# EAGLE design tinyha_blinds2 (EAGLE 7.5.0)
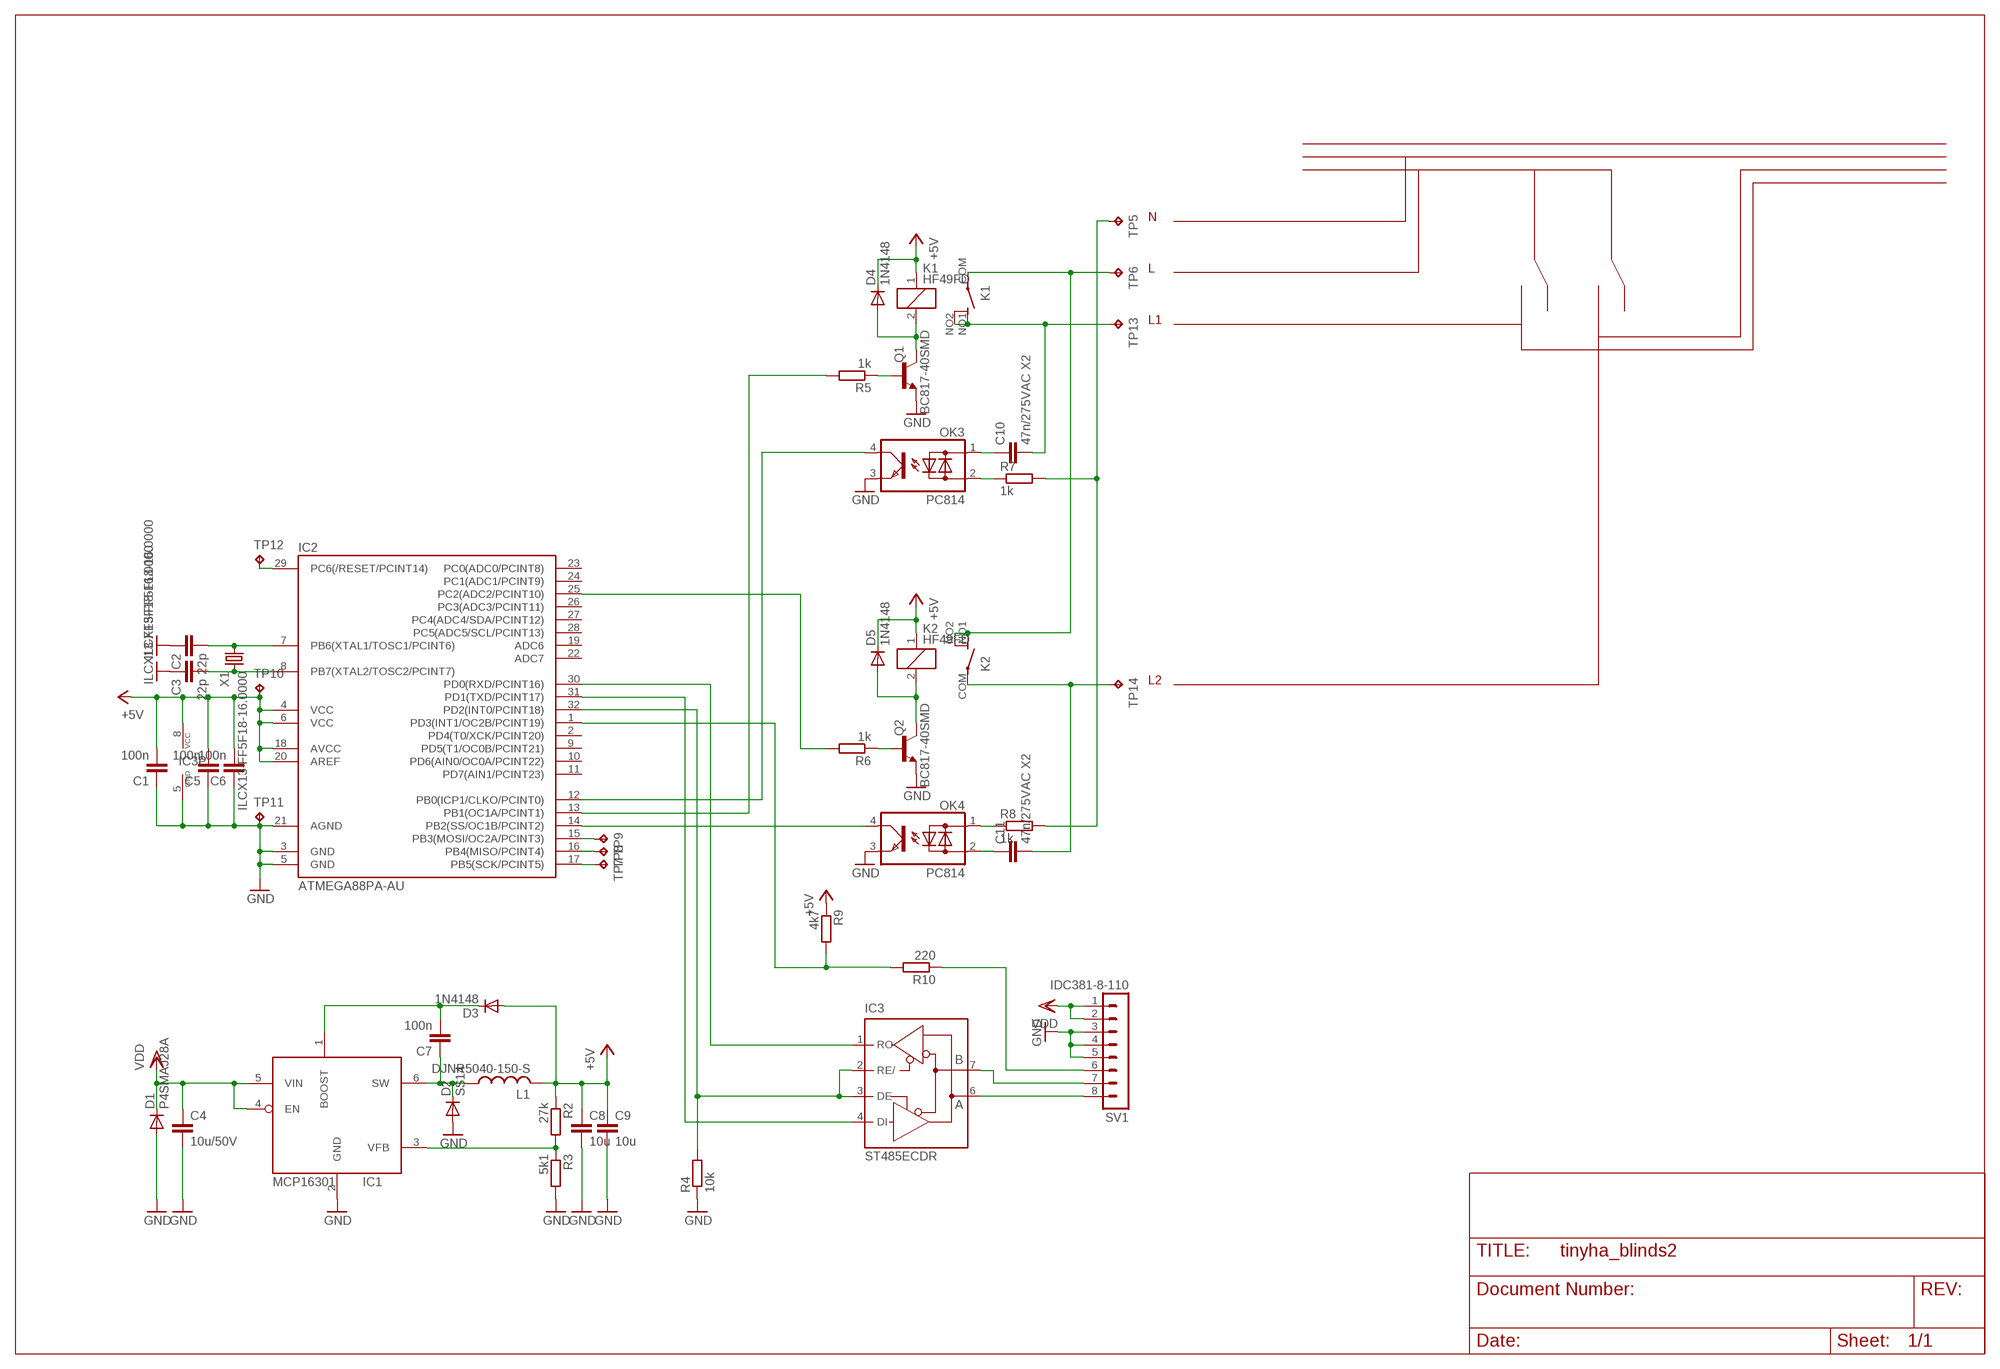
[diagram p0: schematic, sheet 1]

## Parts
C1  100n  C-EUC0603K  [C0603K]
C2  22p  C-EUC0603K  [C0603K]
C3  22p  C-EUC0603K  [C0603K]
C4  10u/50V  C-EUC1210K  [C1210K]
C5  100n  C-EUC0603K  [C0603K]
C6  100n  C-EUC0603K  [C0603K]
C7  100n  C-EUC0603K  [C0603K]
C8  10u  C-EUC0805K  [C0805K]
C9  10u  C-EUC0805K  [C0805K]
C10  47n/275VAC X2  C10/5  [C10B5]
C11  47n/275VAC X2  C10/5  [C10B5]
D1  P4SMAJ28A  DIODE-DO214AC  [DO214AC]
D2  SS14  DIODE-DO214AC  [DO214AC]
D3  1N4148  DIODE-MICROMELF-W  [MICROMELF-W]
D4  1N4148  DIODE-MICROMELF-W  [MICROMELF-W]
D5  1N4148  DIODE-MICROMELF-W  [MICROMELF-W]
IC1  MCP16301  [SOT23-6L]
IC2  ATMEGA88PA-AU  ATMEGA48/88/168-MU  [MLF32]
IC3  ST485ECDR  MAX481CSA  [SO08]
K1  HF49FD  [HF49D]
K2  HF49FD  [HF49D]
L1  DJNR5040-150-S  DJNR5040  [DJNR5040]
OK3  PC814  [DIL04]
OK4  PC814  [DIL04]
Q1  BC817-40SMD  [SOT23-BEC]
Q2  BC817-40SMD  [SOT23-BEC]
R2  27k  R-EU_R0603  [R0603]
R3  5k1  R-EU_R0603  [R0603]
R4  10k  R-EU_R0603  [R0603]
R5  1k  R-EU_R0603  [R0603]
R6  1k  R-EU_R0603  [R0603]
R7  1k  R-EU_0207/10  [0207/10]
R8  1k  R-EU_0207/10  [0207/10]
R9  4k7  R-EU_R0603  [R0603]
R10  220  R-EU_R0603  [R0603]
SV1  IDC381-8-110  MA08-1-IDC  [IDC381-8]
TP5  TP230  [P1-20]
TP6  TP230  [P1-20]
TP7  TPB1,27  [B1,27]
TP8  TPB1,27  [B1,27]
TP9  TPB1,27  [B1,27]
TP10  TPB1,27  [B1,27]
TP11  TPB1,27  [B1,27]
TP12  TPB1,27  [B1,27]
TP13  TP230  [P1-20]
TP14  TP230  [P1-20]
X1  ILCX13-FF5F18-16.0000  XTAL-3225  [SMD3225]

## Nets
+5V: C1.2 C5.2 C6.2 C8.1 C9.1 D3.A D4.C D5.C IC2.4(VCC) IC2.6(VCC) IC2.18(AVCC) IC2.20(AREF) IC3.8(VCC) K1.1 K2.1 L1.2 R2.1 R9.1 TP10.TP
DIR: IC2.32(PD2(INT0/PCINT18)) IC3.2(RE/) IC3.3(DE) R4.2
GND: C1.1 C2.1 C3.1 C4.2 C5.1 C6.1 C8.2 C9.2 D1.A D2.A IC1.2(GND) IC2.3(GND) IC2.5(GND) IC2.21(AGND) IC3.5(GND) OK3.3(E) OK4.3(E) Q1.E Q2.E R3.2 R4.1 SV1.3 SV1.4 SV1.5 TP11.TP X1.2(GND) X1.4(GND)
N$1: R7.2 R8.2 TP5.TP
N$2: C11.2 K2.COM(P) TP14.TP
N$3: C10.2 K1.NO1(S1) K1.NO2(S2) TP13.TP
N$4: Q2.B R6.1
N$5: Q1.B R5.1
N$6: IC2.13(PB1(OC1A/PCINT1)) R5.2
N$7: IC2.25(PC2(ADC2/PCINT10)) R6.2
N$8: IC2.29(PC6(/RESET/PCINT14)) TP12.TP
N$9: IC2.12(PB0(ICP1/CLKO/PCINT0)) OK3.4(C)
N$10: IC3.7(B) SV1.7
N$11: D5.A K2.2 Q2.C
N$12: IC2.14(PB2(SS/OC1B/PCINT2)) OK4.4(C)
N$13: OK4.1(AC1) R8.1
N$14: IC1.3(VFB) R2.2 R3.1
N$15: IC2.15(PB3(MOSI/OC2A/PCINT3)) TP9.TP
N$16: K1.COM(P) K2.NO1(S1) K2.NO2(S2) TP6.TP
N$17: C11.1 OK4.2(AC2)
N$18: R10.1 SV1.6
N$19: IC2.1(PD3(INT1/OC2B/PCINT19)) R9.2 R10.2
N$20: C7.1 D2.C IC1.6(SW) L1.1
N$21: D4.A K1.2 Q1.C
N$22: C7.2 D3.C IC1.1(BOOST)
N$23: IC3.6(A) SV1.8
N$24: C3.2 IC2.8(PB7(XTAL2/TOSC2/PCINT7)) X1.3
N$31: C2.2 IC2.7(PB6(XTAL1/TOSC1/PCINT6)) X1.1
N$55: C10.1 OK3.1(AC1)
N$56: OK3.2(AC2) R7.1
RXD: IC2.30(PD0(RXD/PCINT16)) IC3.1(RO)
TXD: IC2.31(PD1(TXD/PCINT17)) IC3.4(DI)
UH: IC2.16(PB4(MISO/PCINT4)) TP8.TP
VDD: C4.1 D1.C IC1.4(EN) IC1.5(VIN) SV1.1 SV1.2
WH: IC2.17(PB5(SCK/PCINT5)) TP7.TP
Unconnected: IC2.2(PD4(T0/XCK/PCINT20)) IC2.9(PD5(T1/OC0B/PCINT21)) IC2.10(PD6(AIN0/OC0A/PCINT22)) IC2.11(PD7(AIN1/PCINT23)) IC2.19(ADC6) IC2.22(ADC7) IC2.23(PC0(ADC0/PCINT8)) IC2.24(PC1(ADC1/PCINT9)) IC2.26(PC3(ADC3/PCINT11)) IC2.27(PC4(ADC4/SDA/PCINT12)) IC2.28(PC5(ADC5/SCL/PCINT13))

## Notes on the sheet
- N
- L
- L1
- L2

## Library data of the parts
C1-C9 = rcl:C-EU: CAPACITOR, European symbol
C10 C11 = capacitor-wima:C: CAPACITOR naming: grid - package width
D1-D5 = diode:DIODE-: DIODE
IC1 = custom:MCP16301
IC2 = atmega8:ATMEGA48/88/168
IC3 = maxim:MAX481CSA: RS485 TRANSEIVER; MF: MAXIM; MPN: MAX481CSA; OC_FARNELL: unknown; OC_NEWARK: 90C3817
K1 K2 = custom:HF49FD
L1 = custom:DJNR5040
OK3 OK4 = custom:PC814: SHARP OPTO COUPLER; OC_FARNELL: 9707662; OC_NEWARK: unknown
Q1 Q2 = transistor-npn:BC817*: NPN Transistor
R2-R10 = rcl:R-EU_: RESISTOR, European symbol
SV1 = custom:MA08-1: PIN HEADER
TP5 TP6 TP13 TP14 = custom:TP230
TP7-TP12 = testpad:TP: Test pad
X1 = custom:XTAL-3225

## Board
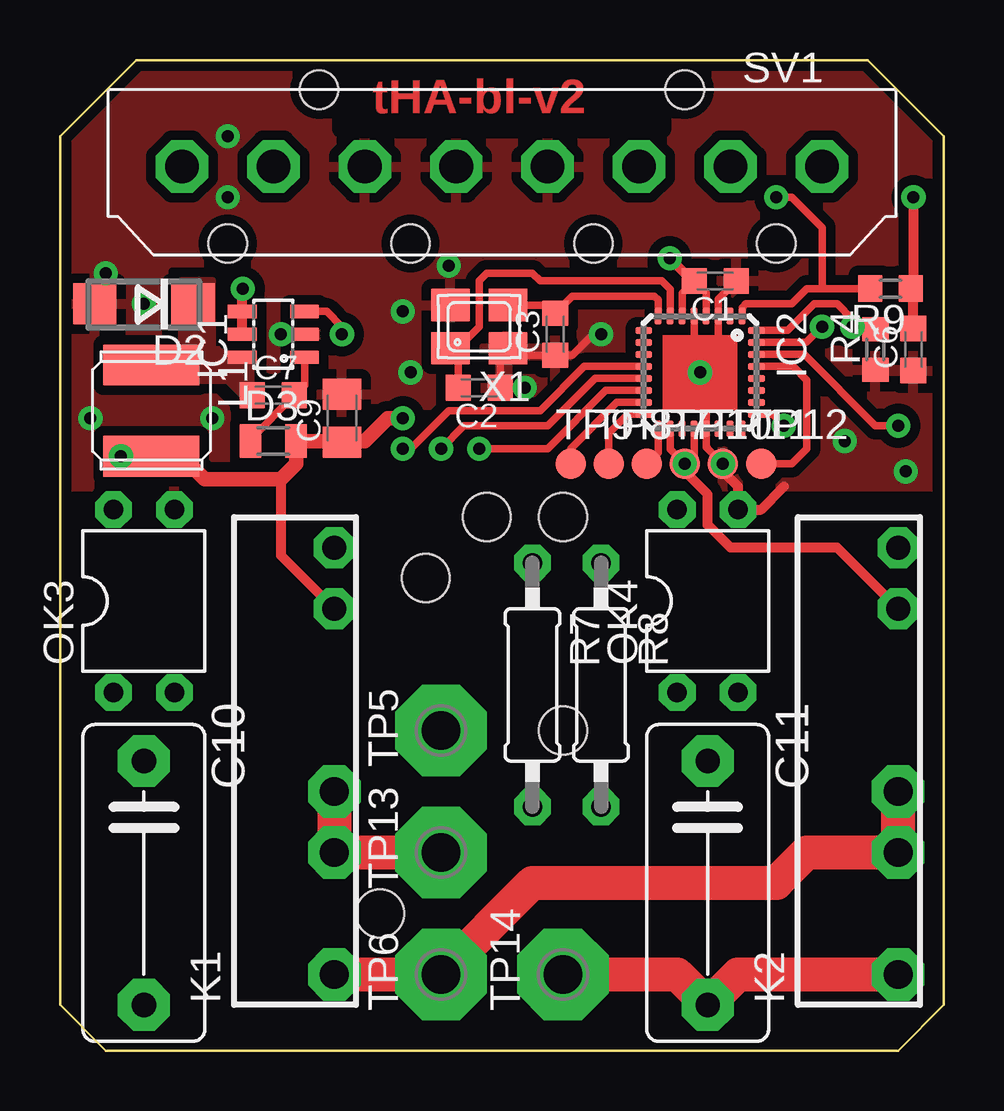
[diagram p1: board, top side]
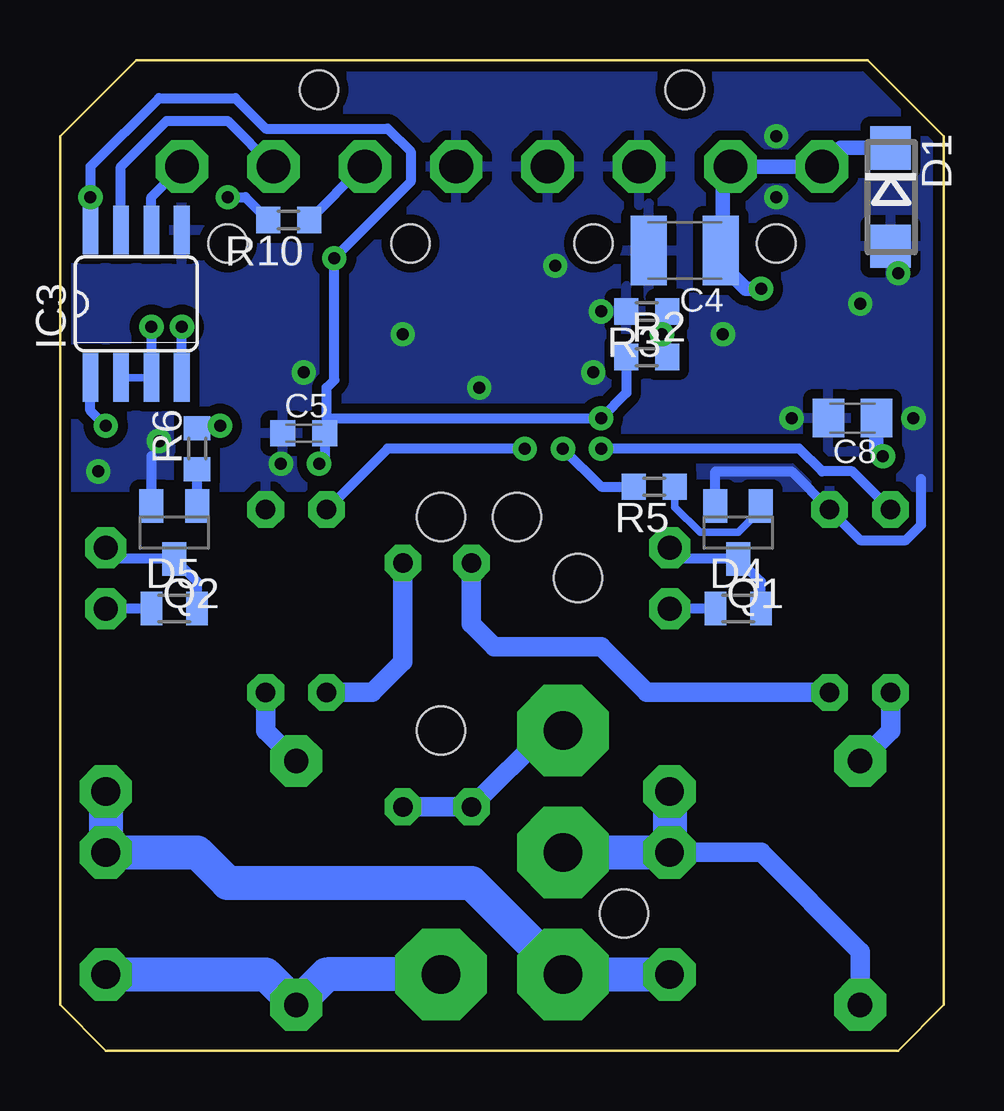
[diagram p2: board, bottom side, seen from below]

Size 36.83 x 41.27 mm. Coordinates in mm from the lower left corner, seen from the top.
Outline: 33.66,41.27 3.17,41.27 0,38.1 0,1.91 1.91,0 34.92,0 36.83,1.91 36.83,38.1 33.66,41.27
Copper layers (1*16): Top 0.035mm / dielectric 1.5mm / Bottom 0.035mm
Design rules "temp *": minimum track width 10mil, minimum drill 0.5mm, track to track 0.19mm, track to pad 0.19mm, pad to pad 0.19mm, via to via 0.2mm, smd to smd 0mil, copper to edge 16mil, drill to drill 8mil, minimum pad ring 14mil, minimum via ring 10mil, stop-mask expansion 4mil, vias tented up to drill 0.6mm, thermal gap 16mil
Holes 2 mm at 15.24,19.68 20.95,22.23 17.78,22.23 20.95,13.34 13.34,5.71
tRestrict: 3 lines

### Footprints (pad centres in the part's own frame; a part is rotated, then mirrored left to right if it is on the bottom)
C0603K = smd 1.05 x 1.08: 1 -0.875,0; 2 0.875,0
C1210K = smd 1.5 x 2.9: 1 -1.5,0; 2 1.5,0
C0805K = smd 1.3 x 1.6: 1 -1,0; 2 1,0
C10B5 = drill 1.016 pad 2.159 octagon: 1 -5.08,0; 2 5.08,0
DO214AC = smd 1.8 x 1.7: A 2.05,0; C -2.05,0
MICROMELF-W = smd 0.9 x 1.4: A 0.95,0; C -0.95,0
SOT23-6L = smd 0.55 x 1.2: 1 -0.95,-1.3; 2 0,-1.3; 3 0.95,-1.3; 4 0.95,1.3; 5 0,1.3; 6 -0.95,1.3
MLF32 = smd 0.7 x 0.3: 1 -2.35,1.75; 2 -2.35,1.25; 3 -2.35,0.75; 4 -2.35,0.25; 5 -2.35,-0.25; 6 -2.35,-0.75; 7 -2.35,-1.25; 8 -2.35,-1.75; 17 2.35,-1.75; 18 2.35,-1.25; 19 2.35,-0.75; 20 2.35,-0.25; 21 2.35,0.25; 22 2.35,0.75; 23 2.35,1.25; 24 2.35,1.75 | smd 0.3 x 0.7: 9 -1.75,-2.35; 10 -1.25,-2.35; 11 -0.75,-2.35; 12 -0.25,-2.35; 13 0.25,-2.35; 14 0.75,-2.35; 15 1.25,-2.35; 16 1.75,-2.35; 25 1.75,2.35; 26 1.25,2.35; 27 0.75,2.35; 28 0.25,2.35; 29 -0.25,2.35; 30 -0.75,2.35; 31 -1.25,2.35; 32 -1.75,2.35
SO08 = smd 0.66 x 2.032: 1 -1.905,-3.073; 2 -0.635,-3.073; 3 0.635,-3.073; 4 1.905,-3.073; 5 1.905,3.073; 6 0.635,3.073; 7 -0.635,3.073; 8 -1.905,3.073
HF49D = drill 1 pad 1.676 octagon: 1 7.62,0; 2 10.16,0 | drill 1.2 pad 2.184 octagon: COM -7.62,0; NO1 -2.54,0; NO2 0,0
DJNR5040 = smd 1.7 x 4: 1 -1.9,0; 2 1.9,0
DIL04 = drill 0.813 pad 1.422 octagon: 1 -1.27,-3.81; 2 1.27,-3.81; 3 1.27,3.81; 4 -1.27,3.81
SOT23-BEC = smd 1 x 1.4: B -0.95,-1.1; C 0,1.1; E 0.95,-1.1
R0603 = smd 1 x 1.1: 1 -0.85,0; 2 0.85,0
0207/10 = drill 0.813 octagon: 1 -5.08,0; 2 5.08,0
IDC381-8 = drill 1.4 pad 2.184 octagon: 1 -13.335,0; 2 -9.525,0; 3 -5.715,0; 4 -1.905,0; 5 1.905,0; 6 5.715,0; 7 9.525,0; 8 13.335,0 | hole 1.6: -11.43,-3.2; -3.81,-3.2; 3.81,-3.2; 11.43,-3.2; -7.62,3.2; 7.62,3.2
P1-20 = drill 1.6 pad 3.81 octagon: TP 0,0
B1,27 = smd 1.27 x 1.27: TP 0,0
SMD3225 = smd 1.6 x 1.35: 1 1.2,0.9; 2 -1.2,0.9; 3 -1.2,-0.9; 4 1.2,-0.9

### Placement (x,y rotation side)
C1  27.3,32.07 180 top
C2  17.46,27.62 180 top
C3  20.64,29.84 90 top
C4  10.79,33.34 180 bottom
C5  26.67,25.72 0 bottom
C6  35.56,29.21 90 top
C7  8.89,27.3 0 top
C8  3.81,26.35 180 bottom
C9  11.75,26.35 90 top
C10  3.49,6.99 270 top
C11  26.99,6.99 270 top
D1  2.22,35.56 270 bottom
D2  3.49,31.11 180 top
D3  8.89,25.4 0 top
D4  8.57,18.41 0 bottom
D5  32.07,18.41 0 bottom
IC1  8.89,29.84 90 top
IC2  26.67,28.26 270 top
IC3  33.66,31.11 0 bottom
K1  11.43,10.79 90 top
K2  34.92,10.79 90 top
L1  3.81,26.67 270 top
OK3  3.49,18.73 0 top
OK4  26.99,18.73 0 top
Q1  8.57,21.59 180 bottom
Q2  32.07,21.59 180 bottom
R2  12.38,28.89 0 bottom
R3  12.38,30.8 180 bottom
R4  33.97,29.21 90 top
R5  12.06,23.5 180 bottom
R6  31.11,25.08 90 bottom
R7  19.68,15.24 270 top
R8  22.54,15.24 270 top
R9  34.61,31.75 180 top
R10  27.3,34.61 180 bottom
SV1  18.41,36.83 0 top
TP5  15.88,13.34 90 top
TP6  15.88,3.17 90 top
TP7  24.45,24.45 0 top
TP8  22.86,24.45 0 top
TP9  21.27,24.45 0 top
TP10  26.04,24.45 0 top
TP11  27.62,24.45 0 top
TP12  29.21,24.45 0 top
TP13  15.88,8.26 90 top
TP14  20.95,3.17 90 top
X1  17.46,30.16 180 top

### Tracks (layer width: path | path; a pad name or v marks a point on that pad's centre or on a via)
+5V  (via drill 0.5)
  Top 0.305: IC2.18 25.42,25.06 TP10.TP 26.42,24.83 IC2.20 | IC2.4 26.92,31.58 C1.2 25.92,31.56 IC2.6
  Top 0.406: 4.19,24.39 L1.2 | C1.2 26.35,32.07 v25.4,33.02 | 9.21,23.81 9.21,20.64 K1.1 | K2.1 32.38,20.95 27.94,20.95 26.99,21.91 26.99,23.18 26.04,24.13 TP10.TP | C9.1 11.48,25.35 11.43,25.4 | v35.56,35.56 35.56,31.85 R9.1 35.56,31.65 C6.2
  Top 0.61: L1.2 5.08,24.77 6.03,23.81 9.21,23.81 9.84,24.45 D3.A 11.43,25.4 | v2.54,24.77 L1.2 | v14.29,26.35 13.65,26.35 12.7,25.4 11.79,25.4 C9.1
  Top 0.813: L1.2
  Bottom 0.406: TP10.TP 25.8,24.69 C5.2 25.72,25.8 25.72,26.35 | 25.72,26.35 25.72,27.62 25.4,27.94 v25.4,33.02 22.23,36.2 22.23,37.47 23.18,38.42 28.26,38.42 29.53,39.69 32.7,39.69 35.56,36.83 v35.56,35.56 IC3.8 | D4.C K1.1 | D5.C K2.1 | R2.1 13.23,27.41 v14.29,26.35 25.72,26.35
  Bottom 0.61: C8.1 2.81,25.04 v2.54,24.77
  other vias: 26.04,24.45
DIR  (via drill 0.5)
  Top 0.305: v33.02,30.16 33.02,30.48 32.38,31.11 31.43,31.11 30.32,30.01 IC2.32
  Top 0.406: v33.02,30.16 33.87,30.16 R4.2
  Bottom 0.305: IC3.3 IC3.2
  Bottom 0.406: v33.02,30.16 IC3.3
GND  (via drill 0.5)
  Top 0.305: C1.1 27.42,31.31 IC2.3 27.42,29.01 v26.67,28.26 | IC2.5 26.42,28.51 v26.67,28.26 | v26.67,28.26 26.92,28.01 IC2.21 26.92,25.15 TP11.TP | C2.1 18.34,28.94 X1.2 18.95,28.97 C3.1 21.35,28.97 22.23,29.84 v22.54,29.84
  Top 0.406: TP11.TP 27.62,24.13 28.26,23.5 OK4.3 29.21,22.54 30.16,23.5
  Bottom 0.406: 0.95,23.81 0.95,21.91 1.59,21.27 3.49,21.27 OK3.3 6.35,24.13 9.53,24.13 9.52,24.13 Q1.E | Q2.E 33.02,24.76 33.02,24.77
  other vias: 9.21,29.84 27.62,24.45 16.19,32.7 14.61,28.26 14.29,30.8 6.35,26.35 1.27,26.35 1.91,32.38 6.99,38.1 6.99,35.56 3.49,31.11 35.24,24.13 32.7,25.4 19.37,27.62
  pour Top (isolate 0.406, rank 2): 0,41.27 36.83,41.27 36.83,23.5 0,23.5
  pour Bottom (isolate 0.406): 0,41.27 36.83,41.27 36.83,23.5 0,23.5
N$1
  Bottom 0.813: R8.2 R7.2 16.51,13.34 TP5.TP
N$2
  Top 1.422: TP14.TP 25.72,3.17 C11.2 28.26,3.17 K2.COM
  Bottom 1.422: TP14.TP 25.72,3.17 C11.2 28.26,3.17 K2.COM
N$3
  Top 1.422: K1.NO2 K1.NO1 TP13.TP
  Bottom 0.813: K1.NO1 7.62,8.26 3.49,4.13 C10.2
  Bottom 1.422: K1.NO2 K1.NO1 TP13.TP
N$4
  Bottom 0.406: Q2.B R6.1
N$5
  Bottom 0.305: Q1.B 7.62,22.54 8.57,21.59 10.16,21.59 11.21,22.64 R5.1
N$6  (via drill 0.5)
  Top 0.305: IC2.13 22.29,28.01 20.32,26.04 16.83,26.04 v15.88,25.08
  Bottom 0.406: v15.88,25.08 14.29,23.5 R5.2
N$7  (via drill 0.5)
  Top 0.305: IC2.25 29.69,26.51 v30.16,26.04
  Bottom 0.406: v30.16,26.04 31.01,26.04 R6.2
N$8
  Top 0.305: 29.59,28.51 IC2.29 30.55,28.51 31.11,27.94 31.11,25.08 30.48,24.45 TP12.TP
N$9  (via drill 0.5)
  Top 0.305: IC2.12 21.84,28.51 20,26.67 16.19,26.67 14.61,25.08 v14.29,25.08
  Bottom 0.406: v14.29,25.08 6.03,25.08 5.08,24.13 3.81,24.13 OK3.4
N$10
  Bottom 0.406: IC3.7 34.29,36.83 32.38,38.73 29.84,38.73 SV1.7
N$11
  Bottom 0.406: D5.A 31.12,19.54 Q2.C 34.46,20.49 K2.2
N$12  (via drill 0.5)
  Top 0.305: IC2.14 22.75,27.51 20.32,25.08 v17.46,25.08
  Bottom 0.406: v17.46,25.08 23.18,25.08 OK4.4
N$13
  Bottom 0.813: R8.1 22.54,16.19 23.81,14.92 OK4.1
N$14  (via drill 0.5)
  Top 0.305: v11.75,29.84 11.75,30.16 11.11,30.8 IC1.3
  Bottom 0.305: R2.2 11.75,29.11 v11.75,29.84 11.75,30.58 R3.1
N$15
  Top 0.305: IC2.15 23.2,27.01 21.27,25.08 TP9.TP
N$16
  Top 1.422: K1.COM TP6.TP 19.68,6.99 29.84,6.99 31.11,8.26 K2.NO1 K2.NO2
  Bottom 1.422: K2.NO2 K2.NO1 31.11,8.26 29.84,6.99 19.68,6.99 TP6.TP K1.COM
N$17
  Bottom 0.813: OK4.2 28.26,13.34 C11.1
N$18
  Bottom 0.406: SV1.6 24.23,36.83 R10.1
N$19  (via drill 0.5)
  Top 0.305: IC2.1 28.42,30.96 28.57,31.11 30.48,31.11 31.11,31.75 31.75,31.75 | R9.2 31.75,31.75 | 31.75,31.75 31.75,34.29 30.48,35.56 v29.84,35.56
  Bottom 0.406: v29.84,35.56 29.11,35.56 R10.2
N$20
  pour Top (isolate 0.406, no thermals): 5.08,32.07 5.08,27.94 6.99,27.94 7.62,27.3 7.94,27.3 7.94,29.21 6.35,29.21 6.35,32.07
N$21
  Bottom 0.406: K1.2 10.96,20.49 Q1.C 7.62,19.54 D4.A
N$22
  Top 0.305: IC1.1 10.19,27.73 C7.2 7.94,25.48 D3.C
N$23
  Bottom 0.406: IC3.6 33.02,35.56 SV1.8
N$24
  Top 0.305: IC2.8 24.92,31.28 24.77,31.43 21.35,31.43 C3.2 20.3,31.06 X1.3
N$31
  Top 0.305: IC2.7 25.42,31.73 25.08,32.07 20,32.07 19.68,32.38 17.78,32.38 17.46,32.07 17.46,30.16 16.56,29.26 X1.1 16.59,28.94 C2.2
N$55
  Bottom 0.813: OK3.1 2.22,13.34 C10.1
N$56
  Bottom 0.813: OK3.2 12.38,14.92 14.29,16.83 18.73,16.83 19.68,17.78 R7.1
RXD  (via drill 0.5)
  Top 0.305: v34.92,26.04 33.97,26.04 31,29.01 IC2.30
  Bottom 0.406: v34.92,26.04 35.56,26.67 IC3.1
TXD  (via drill 0.5)
  Top 0.305: IC2.31 31.09,29.51 v31.75,30.16
  Bottom 0.406: IC3.4 v31.75,30.16
UH
  Top 0.305: IC2.16 23.65,26.51 22.86,25.72 TP8.TP
VDD  (via drill 0.5)
  Top 0.406: IC1.5 IC1.4 7.59,31.72 v7.62,31.75
  Bottom 0.61: 9.21,33.42 9.21,35.88 8.89,36.2 SV1.2 SV1.1 4.3,37.61 D1.C | v7.62,31.75 8.26,31.75 9.53,33.02 9.53,33.11 C4.1
  Bottom 0.813: 9.21,33.42 C4.1 9.21,33.25
WH
  Top 0.305: IC2.17 24.92,24.92 TP7.TP

### Text on the board
Top: tHA-bl-v2